# EAGLE design x-talk (EAGLE 6.6.0)
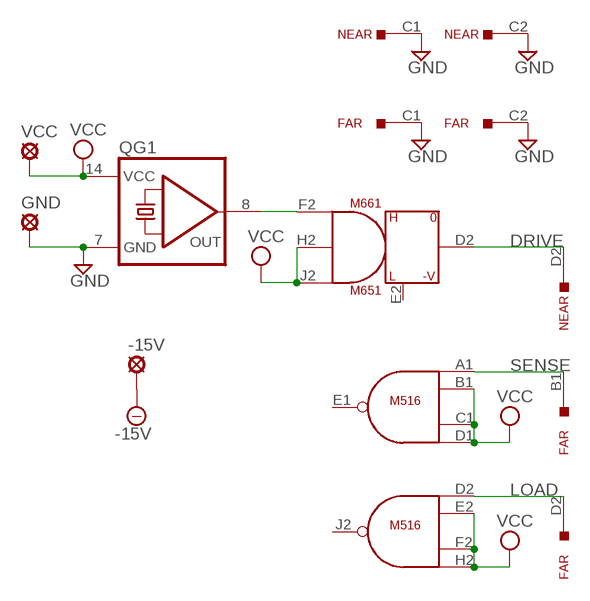
[diagram p0: schematic, sheet 1]

## Parts
-15V  SE11  [SE11]
FAR  M916  [H807]
GND  SE11  [SE11]
M516  M117  [H807]
M661  M651  [H807]
NEAR  M916  [H807]
QG1  QG5860  [DIL14S]
VCC  SE11  [SE11]

## Nets
-15V: -15V.MP
DRIVE: M661.D2(D:OUT) NEAR.D2
GND: FAR.C1 FAR.C2 GND.MP NEAR.C1 NEAR.C2 QG1.7(GND)
LOAD: FAR.D2 M516.D2(J2:IN1)
N$1: M661.F2(D:IN1) QG1.8(OUT)
SENSE: FAR.B1 M516.A1(E1:IN1)
VCC: M516.B1(E1:IN2) M516.C1(E1:IN3) M516.D1(E1:IN4) M516.E2(J2:IN2) M516.F2(J2:IN3) M516.H2(J2:IN4) M661.H2(D:IN2) M661.J2(D:IN3) QG1.14(VCC) VCC.MP
Unconnected: FAR.A1 FAR.A2 FAR.B2 FAR.D1 FAR.E1 FAR.E2 FAR.F1 FAR.F2 FAR.H1 FAR.H2 FAR.J1 FAR.J2 FAR.K1 FAR.K2 FAR.L1 FAR.L2 FAR.M1 FAR.M2 FAR.N1 FAR.N2 FAR.P1 FAR.P2 FAR.R1 FAR.R2 FAR.S1 FAR.S2 FAR.T1 FAR.T2 FAR.U1 FAR.U2 FAR.V1 FAR.V2 M516.E1(E1:OUT) M516.F1(L1:IN1) M516.H1(L1:IN2) M516.J1(L1:IN3) M516.J2(J2:OUT) M516.K1(L1:IN4) M516.K2(P2:IN1) M516.L1(L1:OUT) M516.L2(P2:IN2) M516.M1(S1:IN1) M516.M2(P2:IN3) M516.N1(S1:IN2) M516.N2(P2:IN4) M516.P1(S1:IN3) M516.P2(P2:OUT) M516.R1(S1:IN4) M516.R2(V2:IN1) M516.S1(S1:OUT) M516.S2(V2:IN2) M516.T2(V2:IN3) M516.U1 M516.U2(V2:IN4) M516.V1 M516.V2(V2:OUT) M661.E2(D:SLOW) M661.K2(K:OUT) M661.L2(K:SLOW) M661.M2(K:IN1) M661.N2(K:IN2) M661.P2(K:IN3) M661.R2(S:SLOW) M661.S2(S:OUT) M661.T2(S:IN1) M661.U2(S:IN2) M661.V2(S:IN3) NEAR.A1 NEAR.A2 NEAR.B1 NEAR.B2 NEAR.D1 NEAR.E1 NEAR.E2 NEAR.F1 NEAR.F2 NEAR.H1 NEAR.H2 NEAR.J1 NEAR.J2 NEAR.K1 NEAR.K2 NEAR.L1 NEAR.L2 NEAR.M1 NEAR.M2 NEAR.N1 NEAR.N2 NEAR.P1 NEAR.P2 NEAR.R1 NEAR.R2 NEAR.S1 NEAR.S2 NEAR.T1 NEAR.T2 NEAR.U1 NEAR.U2 NEAR.V1 NEAR.V2

## Power pins joined to a net without a drawn wire
-15V: M661.B2(-15V)
GND: M516.C2(GND) M516.T1(GND) M661.C2(GND)
VCC: M516.A2(VCC) M661.A2(VCC)

## Library data of the parts
-15V GND VCC = solpad:SE11: SOLDER PAD RTM, drill 1,1mm, distributor Buerklin, 07F810
FAR NEAR = dec-m:M916: Simple 36 pin connector/wire cable
M516 = dec-m:M117: 6 4-input NAND Gates
M661 = dec-m:M651: M651 - Negative Output Converter
QG1 = crystal:QG5860: CRYSTAL RESONATOR; OC_FARNELL: unknown; OC_NEWARK: unknown

## Net classes
0 default: width 0.508 mm

## Board
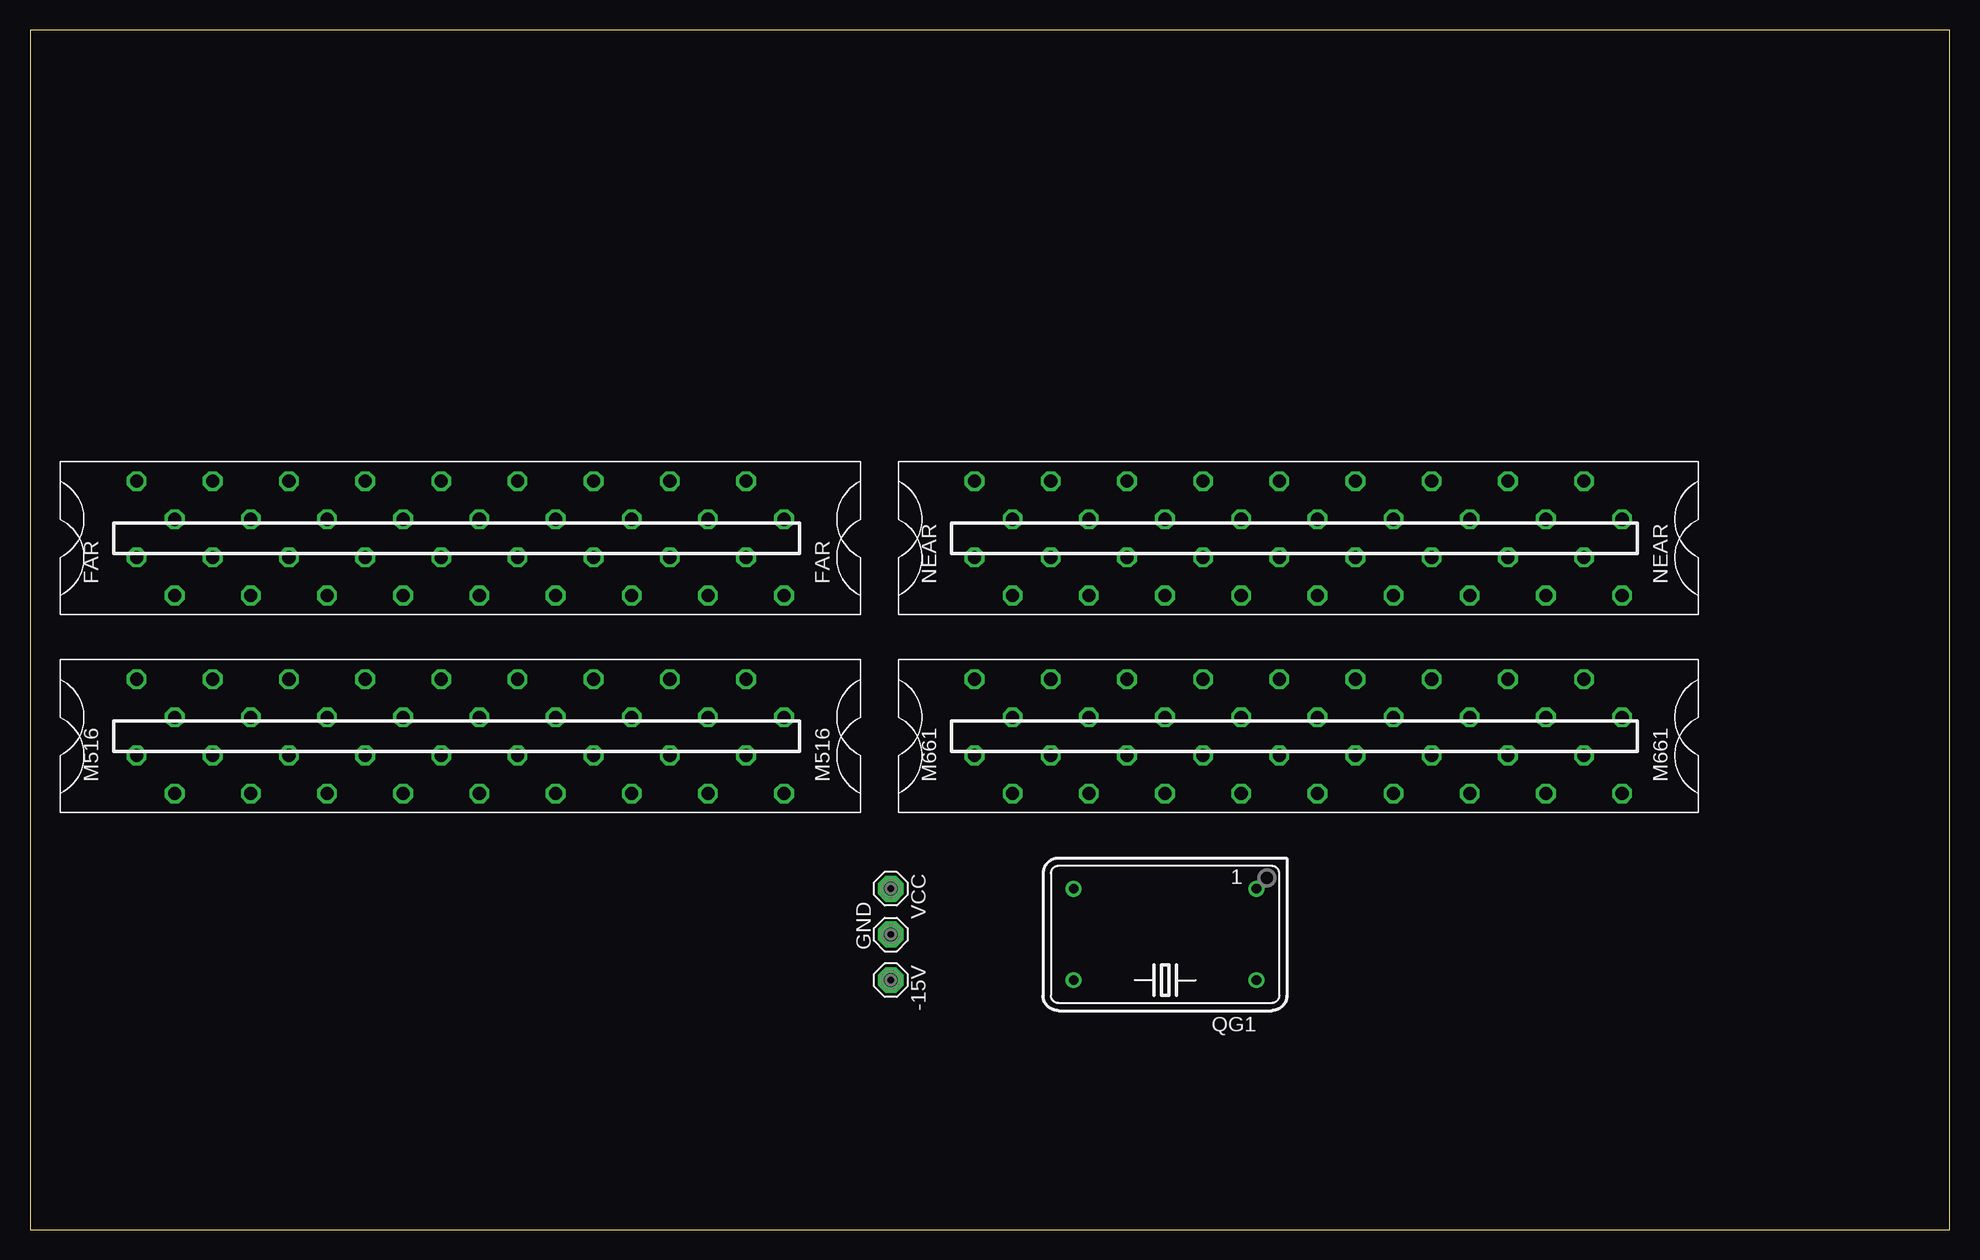
[diagram p1: board, top side]
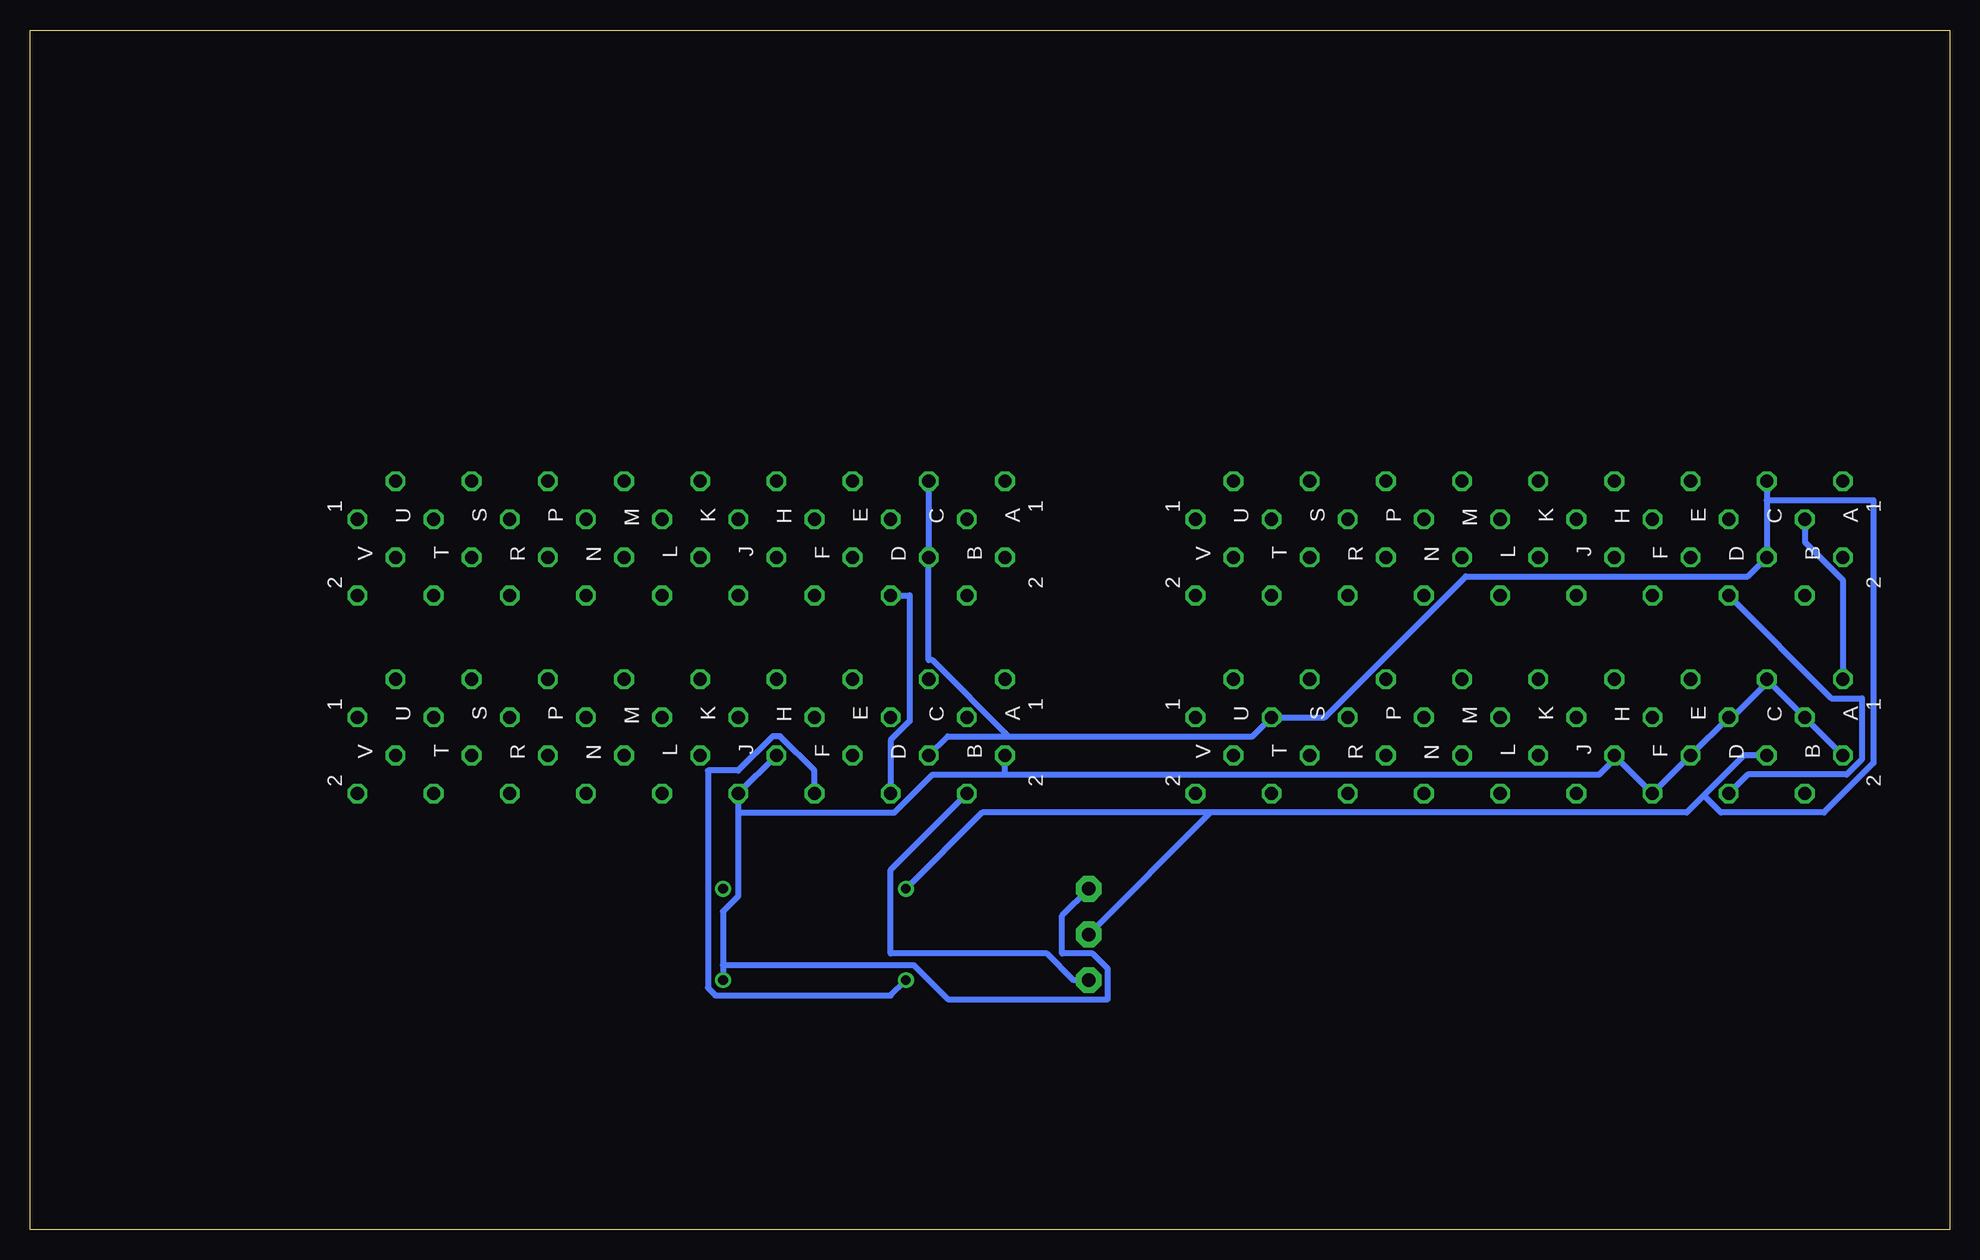
[diagram p2: board, bottom side, seen from below]

Size 160 x 100 mm. Coordinates in mm from the lower left corner, seen from the top.
Outline: 0,0 160,0 160,100 0,100 0,0
Copper layers (1+16): Top 0.035mm / dielectric 1.5mm / Bottom 0.035mm
Design rules "16mils": minimum track width 16mil, minimum drill 32mil, track to track 15mil, track to pad 10mil, pad to pad 10mil, via to via 10mil, smd to smd 10mil, copper to edge 13mil, drill to drill 10mil, minimum pad ring 10mil, minimum via ring 8mil, stop-mask expansion 0mil, vias tented up to drill 0mil, thermal gap 10mil

### Footprints (pad centres in the part's own frame; a part is rotated, then mirrored left to right if it is on the bottom)
SE11 = drill 1.118 pad 2.159 octagon: MP 0,0
H807 = drill 1.092 octagon: A1 4.763,28.575; A2 -1.587,28.575; B1 1.587,25.4; B2 -4.763,25.4; C1 4.763,22.225; C2 -1.587,22.225; D1 1.587,19.05; D2 -4.763,19.05; E1 4.763,15.875; E2 -1.587,15.875; F1 1.587,12.7; F2 -4.763,12.7; H1 4.763,9.525; H2 -1.587,9.525; J1 1.587,6.35; J2 -4.763,6.35; K1 4.763,3.175; K2 -1.587,3.175; L1 1.587,0; L2 -4.763,0; M1 4.763,-3.175; M2 -1.587,-3.175; N1 1.587,-6.35; N2 -4.763,-6.35; P1 4.763,-9.525; P2 -1.587,-9.525; R1 1.587,-12.7; R2 -4.763,-12.7; S1 4.763,-15.875; S2 -1.587,-15.875; T1 1.587,-19.05; T2 -4.763,-19.05; U1 4.763,-22.225; U2 -1.587,-22.225; V1 1.587,-25.4; V2 -4.763,-25.4
DIL14S = drill 0.813: 1 -7.62,-3.81; 7 7.62,-3.81; 8 7.62,3.81; 14 -7.62,3.81

### Placement (x,y rotation side)
-15V  71.75,20.79 270 top
FAR  37.46,57.62 90 top
GND  71.75,24.6 90 top
M516  37.46,41.11 90 top
M661  107.31,41.11 90 top
NEAR  107.31,57.62 90 top
QG1  94.61,24.6 180 top
VCC  71.75,28.41 270 top

### Tracks (layer width: path | path; a pad name or v marks a point on that pad's centre or on a via)
-15V
  Bottom 0.508: M661.B2 88.26,30 88.26,23.01 75.24,23.01 73.02,20.79 -15V.MP
DRIVE
  Bottom 0.508: M661.D2 88.26,40.79 86.67,42.38 86.67,52.86 NEAR.D2
GND
  Bottom 0.508: QG1.7 80.64,34.76 61.59,34.76 | 61.59,34.76 21.9,34.76 20.47,36.19 | 20.47,36.19 17.14,39.52 M516.C2 | NEAR.C1 NEAR.C2 85.08,47.46 84.77,47.46 78.42,41.11 | FAR.C1 15.24,60.8 | 15.24,60.8 FAR.C2 16.82,54.45 40.32,54.45 52.07,42.7 M516.T1 58.1,41.11 78.42,41.11 | 78.42,41.11 83.5,41.11 M661.C2 | 20.47,36.19 19.04,34.76 10.47,34.76 6.34,38.89 6.34,60.8 15.24,60.8 | 61.59,34.76 GND.MP
LOAD
  Bottom 0.508: M516.D2 16.82,37.94 8.57,37.94 7.3,39.2 7.3,44.28 9.84,44.28 FAR.D2
N$1
  Bottom 0.508: QG1.8 88.26,19.52 102.86,19.52 103.5,20.15 103.5,38.25 100.96,38.25 98.1,41.11 97.47,41.11 94.61,38.25 M661.F2
SENSE
  Bottom 0.508: M516.A1 8.89,54.13 12.06,57.3 FAR.B1
VCC
  Bottom 0.508: M516.A2 M516.B1 M516.C1 15.24,45.55 18.09,42.7 M516.D1 M516.E2 M516.F2 24.76,36.66 25.08,36.66 M516.H2 27.93,39.2 29.2,37.94 78.73,37.94 | 102.23,22.06 102.23,26.5 100.96,27.77 100.96,34.76 | 102.23,22.06 QG1.14 | 100.96,34.76 M661.J2 M661.H2 | 78.73,37.94 M661.A2 | 100.96,34.76 87.94,34.76 84.77,37.94 78.73,37.94 | VCC.MP 73.97,26.19 73.97,23.01 71.43,23.01 70.16,21.74 70.16,19.2 83.5,19.2 86.35,22.06 102.23,22.06